# EasyEDA schematic SCH_Motor_PCB_2026-05-03.json
TITLE: Sheet_1; REV: 1.0; Date: 2025-08-23; Sheet: 1/1; Drawn By: rahber; Company: Your Company
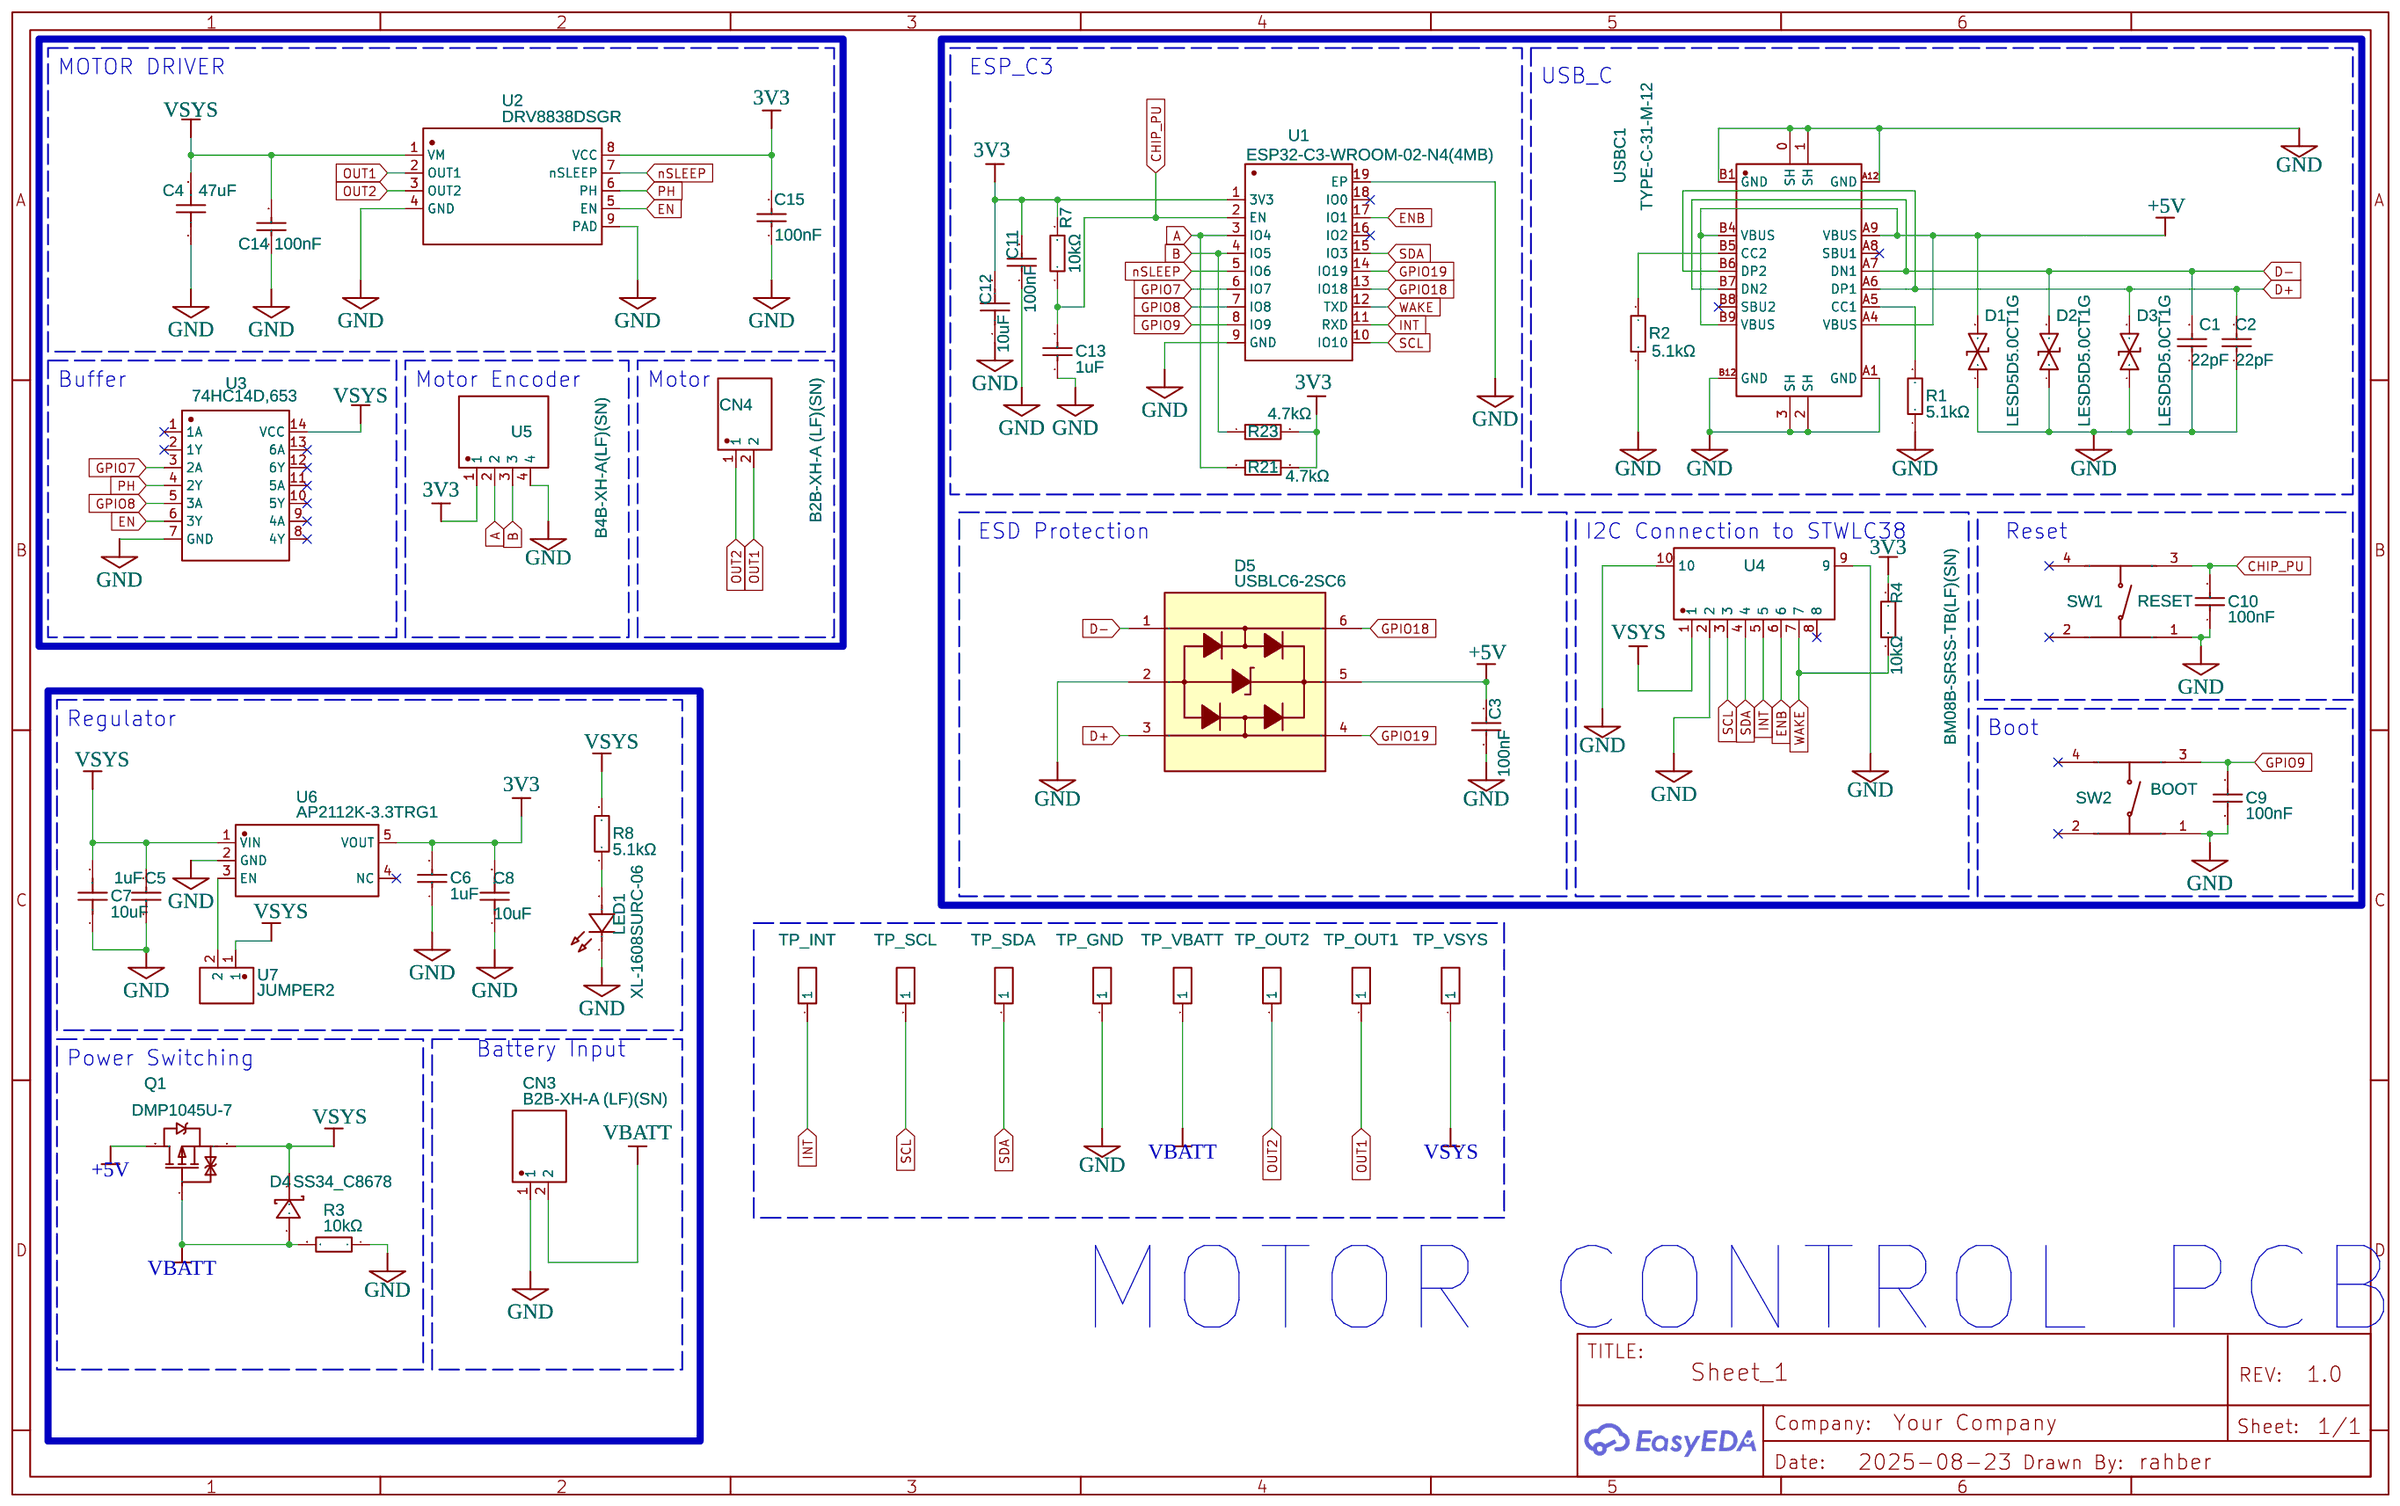
[diagram p0: schematic sheet]

## Parts
BOOT  SW2  [SW-SMD_4P-L6.2-W6.5-P4.50-LS8.5]
C1  22pF  [C0603]
C2  22pF  [C0603]
C3  100nF  [C0603]
C4  47uF  [C0805]
C5  1uF  [C0603]
C6  1uF  [C0603]
C7  10uF  [C0603]
C8  10uF  [C0603]
C9  100nF  [C0603]
C10  100nF  [C0603]
C11  100nF  [C0603]
C12  10uF  [C0603]
C13  1uF  [C0603]
C14  100nF  [C0603]
C15  100nF  [C0603]
CN3  B2B-XH-A (LF)(SN)  [CONN-TH_B2B-XH-A-LF-SN]
CN4  B2B-XH-A (LF)(SN)  [CONN-TH_B2B-XH-A-LF-SN]
D1  LESD5D5.0CT1G  [SOD-523_L1.2-W0.8-LS1.6-BI]
D2  LESD5D5.0CT1G  [SOD-523_L1.2-W0.8-LS1.6-BI]
D3  LESD5D5.0CT1G  [SOD-523_L1.2-W0.8-LS1.6-BI]
D4  SS34_C8678  [SMA_L4.3-W2.6-LS5.2-RD]
D5  USBLC6-2SC6  [SOT-23-6_L2.9-W1.6-P0.95-LS2.8-BL]
LED1  XL-1608SURC-06  [LED0603-RD_RED]
Q1  DMP1045U-7  [SOT-23-3_L2.9-W1.3-P1.90-LS2.4-BR]
R1  5.1kΩ  [R0603]
R2  5.1kΩ  [R0603]
R3  10kΩ  [R0603]
R4  10kΩ  [R0603]
R7  10kΩ  [R0603]
R8  5.1kΩ  [R0603]
R21  4.7kΩ  [R0805]
R23  4.7kΩ  [R0805]
RESET  SW1  [SW-SMD_4P-L6.2-W6.5-P4.50-LS8.5]
TP_GND  HDR-M-2.54_1x1  [HDR-M-2.54_1X1]
TP_INT  HDR-M-2.54_1x1  [HDR-M-2.54_1X1]
TP_OUT1  HDR-M-2.54_1x1  [HDR-M-2.54_1X1]
TP_OUT2  HDR-M-2.54_1x1  [HDR-M-2.54_1X1]
TP_SCL  HDR-M-2.54_1x1  [HDR-M-2.54_1X1]
TP_SDA  HDR-M-2.54_1x1  [HDR-M-2.54_1X1]
TP_VBATT  HDR-M-2.54_1x1  [HDR-M-2.54_1X1]
TP_VSYS  HDR-M-2.54_1x1  [HDR-M-2.54_1X1]
U1  ESP32-C3-WROOM-02-N4(4MB)  [BULETM-SMD_ESPRESSIF_ESP32-C3-WROOM-02-N4-4MB]
U2  DRV8838DSGR  [WSON-8_L2.0-W2.0-P0.50-TL-EP]
U3  74HC14D,653  [SOIC-14_L8.7-W3.9-P1.27-LS6.0-BL]
U4  BM08B-SRSS-TB(LF)(SN)  [CONN-TH_BM08B-SRSS-TB-LF-SN]
U5  B4B-XH-A(LF)(SN)  [CONN-TH_B4B-XH-A-LF-SN]
U6  AP2112K-3.3TRG1  [SOT-25-5_L2.9-W1.6-P0.95-LS2.8-BL]
U7  JUMPER2  [HDR-TH_2P-P2.54-V-M-1]
USBC1  TYPE-C-31-M-12  [USB-C_SMD-TYPE-C-31-M-12]

## Library data of the parts
BOOT RESET = TS-1157-C-E: Contributor: LCSC; Supplier: LCSC; Supplier Part: C609869; Manufacturer: XKB Connectivity(中国星坤); JLCPCB Part Class: Extended Part
C1 C2 = CL10C220JB8NNNC: Supplier: LCSC; Manufacturer: SAMSUNG(三星); Supplier Part: C1653; JLCPCB Part Class: Basic Part
C3 C9-C11 C14 C15 = CT41G-0603-2X1-50V-0.1μF-K(N): Contributor: LCSC; Supplier: LCSC; Manufacturer: TORCH(火炬); Supplier Part: C125205; JLCPCB Part Class: Extended Part
C4 = CGA0805X5R476M100MT: Supplier: LCSC; Supplier Part: C6119904; Manufacturer: HRE(芯声); JLCPCB Part Class: Extended Part; Contributor: lcsc
C5 C6 C13 = CL10A105KO8NNNC: Supplier: LCSC; Manufacturer: SAMSUNG(三星); Supplier Part: C1592; JLCPCB Part Class: Extended Part
C7 C8 C12 = CL10A106MA8NRNC: Supplier: LCSC; Manufacturer: SAMSUNG(三星); Supplier Part: C96446; JLCPCB Part Class: Basic Part
CN3 CN4 = B2B-XH-A (LF)(SN): Contributor: LCSC; Supplier: LCSC; Supplier Part: C158012; Manufacturer: JST; Manufacturer Part: B2B-XH-A(LF)(SN); JLCPCB Part Class: Extended Part
D1-D3 = LESD5D5.0CT1G: Contributor: LCSC; Supplier: LCSC; Supplier Part: C383211; Manufacturer: LRC(乐山无线电); JLCPCB Part Class: Extended Part
D4 = SS34_C8678: Supplier: LCSC; Manufacturer Part: SS34; Manufacturer: MDD(辰达半导体); Supplier Part: C8678; JLCPCB Part Class: Basic Part
D5 = USBLC6-2SC6: Supplier: LCSC; Manufacturer: ST(意法半导体); Supplier Part: C7519; JLCPCB Part Class: Extended Part
LED1 = XL-1608SURC-06: Contributor: LCSC; Supplier: LCSC; Supplier Part: C965799; Manufacturer: XINGLIGHT(成兴光); JLCPCB Part Class: Extended Part
Q1 = DMP1045U-7: Contributor: LCSC; Supplier: LCSC; Supplier Part: C177033; Manufacturer: DIODES(美台); JLCPCB Part Class: Extended Part
R1 R2 R8 = RC0603FR-075K1L: Supplier: LCSC; Manufacturer: YAGEO(国巨); Supplier Part: C105580; JLCPCB Part Class: Extended Part
R3 R4 R7 = RC0603FR-0710KL: Supplier: LCSC; Manufacturer: YAGEO(国巨); Supplier Part: C98220; JLCPCB Part Class: Extended Part
R21 R23 = 0805W8F4701T5E: Supplier: LCSC; Manufacturer: UNI-ROYAL(厚声); Supplier Part: C17673; JLCPCB Part Class: Basic Part
TP_GND TP_INT TP_OUT1 TP_OUT2 TP_SCL TP_SDA TP_VBATT TP_VSYS = HDR-M-2.54_1x1: Supplier Part: C81276; Supplier: LCSC; Contributor: LCEDA_Lib
U1 = ESP32-C3-WROOM-02-N4(4MB): Contributor: LCSC; Supplier: LCSC; Supplier Part: C2934560; Manufacturer: ESPRESSIF(乐鑫); Manufacturer Part: ESP32-C3-WROOM-02-N4; JLCPCB Part Class: Extended Part
U2 = DRV8838DSGR: Supplier: LCSC; Manufacturer: TI(德州仪器); Supplier Part: C86667; JLCPCB Part Class: Extended Part
U3 = 74HC14D,653: Supplier: LCSC; Manufacturer: Nexperia(安世); Supplier Part: C5605; JLCPCB Part Class: Basic Part
U4 = BM08B-SRSS-TB(LF)(SN): Contributor: LCSC; Supplier: LCSC; Supplier Part: C160394; Manufacturer: JST; JLCPCB Part Class: Extended Part
U5 = B4B-XH-A(LF)(SN): Contributor: LCSC; Supplier: LCSC; Supplier Part: C144395; Manufacturer: JST; JLCPCB Part Class: Extended Part
U6 = AP2112K-3.3TRG1: Contributor: LCSC; Supplier: LCSC; Manufacturer: DIODES(美台); Supplier Part: C51118; JLCPCB Part Class: Extended Part
U7 = JUMPER2: Contributor: LCSC; Supplier: LCSC; Supplier Part: C2940092; Manufacturer: null; Manufacturer Part: Jumper2; JLCPCB Part Class: Extended Part
USBC1 = TYPE-C-31-M-12: Contributor: LCSC; Supplier: LCSC; Supplier Part: C165948; Manufacturer: 韩国韩荣; JLCPCB Part Class: Extended Part

## Nets
3V3: C6.2 C8.2 C11.2 C12.2 C15.2 R4.1 R7.2 R21.2 R23.2 U1.1(3V3) U2.8(VCC) U5.1 U6.5(VOUT)
+5V: C3.2 D1.2 D5.5 Q1.3(D) USBC1.A4(VBUS) USBC1.A9(VBUS) USBC1.B4(VBUS) USBC1.B9(VBUS)
GND: BOOT.1(A) C1.1 C2.1 C3.1 C4.1 C5.1 C6.1 C7.1 C8.1 C9.1 C10.1 C11.1 C12.1 C13.1 C14.1 C15.1 CN3.1 D1.1 D2.1 D3.1 D5.2 LED1.1(K) R1.1 R2.1 R3.1 RESET.1(A) TP_GND.1 U1.9(GND) U1.19(EP) U2.4(GND) U2.9(PAD) U3.7(GND) U4.2 U4.9 U4.10 U5.4 U6.2(GND) USBC1.0(SH) USBC1.1(SH) USBC1.2(SH) USBC1.3(SH) USBC1.A1(GND) USBC1.A12(GND) USBC1.B1(GND) USBC1.B12(GND)
VBATT: CN3.2 D4.2(A) Q1.1(G) R3.2 TP_VBATT.1
A: R21.1 U1.3(IO4) U5.2
B: R23.1 U1.4(IO5) U5.3
CHIP_PU: C10.2 C13.2 R7.1 RESET.3(C) U1.2(EN)
D+: C2.2 D3.2 D5.3 USBC1.A6(DP1) USBC1.B6(DP2)
D-: C1.2 D2.2 D5.1 USBC1.A7(DN1) USBC1.B7(DN2)
EN: U2.5(EN) U3.6(3Y)
ENB: U1.17(IO1) U4.6
GPIO7: U1.6(IO7) U3.3(2A)
GPIO8: U1.7(IO8) U3.5(3A)
GPIO9: BOOT.3(C) C9.2 U1.8(IO9)
GPIO18: D5.6 U1.13(IO18)
GPIO19: D5.4 U1.14(IO19)
INT: TP_INT.1 U1.11(RXD) U4.5
nSLEEP: U1.5(IO6) U2.7(nSLEEP)
OUT1: CN4.2 TP_OUT1.1 U2.2(OUT1)
OUT2: CN4.1 TP_OUT2.1 U2.3(OUT2)
PH: U2.6(PH) U3.4(2Y)
SCL: TP_SCL.1 U1.10(IO10) U4.3
SDA: TP_SDA.1 U1.15(IO3) U4.4
VSYS: C4.2 C5.2 C7.2 C14.2 D4.1(K) Q1.2(S) R8.2 TP_VSYS.1 U2.1(VM) U3.14(VCC) U4.1 U6.1(VIN) U7.1
WAKE: R4.2 U1.12(TXD) U4.7
Net-(LED1-2): LED1.2(A) R8.1
Net-(R1-2): R1.2 USBC1.A5(CC1)
Net-(R2-2): R2.2 USBC1.B5(CC2)
Net-(U6-3): U6.3(EN) U7.2

Not connected (* = marked no-connect by the designer): BOOT 2(B)* 4(D)*; RESET 2(B)* 4(D)*; U1 16(IO2)* 18(IO0)*; U3 1(1A)* 2(1Y)* 8(4Y)* 9(4A)* 10(5Y)* 11(5A)* 12(6Y)* 13(6A)*; U4 8*; U6 4(NC)*; USBC1 A8(SBU1)* B8(SBU2)*

## Notes on the sheet
- MOTOR DRIVER
- ESP_C3
- USB_C
- Buffer
- Motor Encoder
- Motor
- ESD Protection
- I2C Connection to STWLC38
- Reset
- Regulator
- Boot
- Power Switching
- Battery Input
- MOTOR CONTROL PCB
